# EAGLE design Prius Adaptor PCB Horizontal (EAGLE 9.4.0)
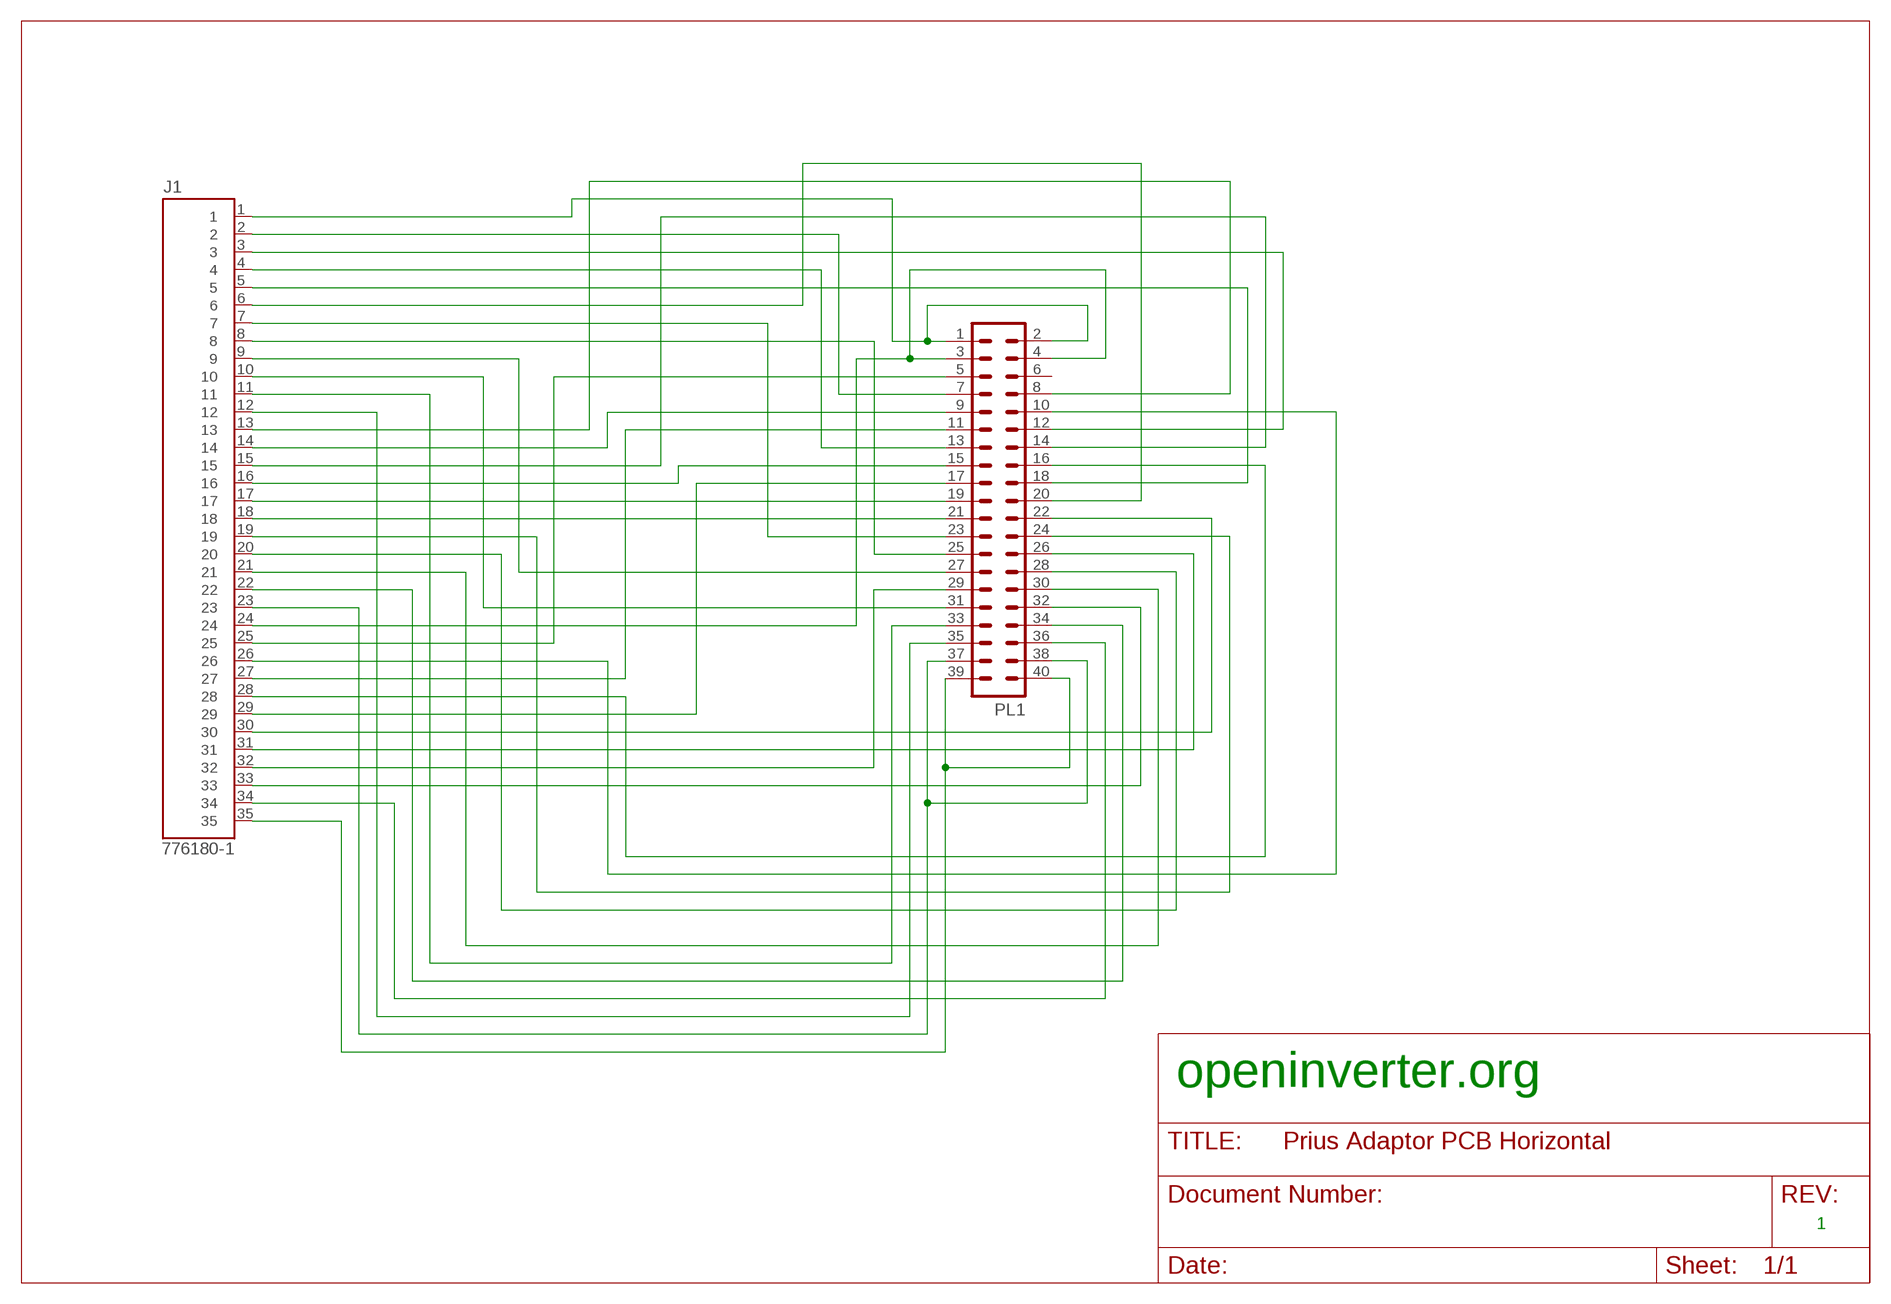
[diagram p0: schematic, sheet 1]

## Parts
J1  776180-1  [TE_776180-1]
PL1  40HNONLATCH  [40HNONLATCH]

## Nets
N$1: J1.6 PL1.20
N$2: J1.17 PL1.19
N$3: J1.29 PL1.17
N$4: J1.5 PL1.18
N$5: J1.16 PL1.15
N$6: J1.28 PL1.16
N$7: J1.4 PL1.13
N$8: J1.15 PL1.14
N$9: J1.27 PL1.11
N$10: J1.3 PL1.12
N$11: J1.14 PL1.9
N$12: J1.26 PL1.10
N$13: J1.2 PL1.7
N$14: J1.13 PL1.8
N$15: J1.25 PL1.5
N$16 [Power]: J1.1 PL1.1 PL1.2
N$17 [Power]: J1.24 PL1.3 PL1.4
N$18: J1.7 PL1.23
N$19: J1.18 PL1.21
N$20: J1.30 PL1.22
N$21: J1.8 PL1.25
N$22: J1.19 PL1.24
N$23: J1.31 PL1.26
N$24: J1.9 PL1.27
N$25: J1.20 PL1.28
N$26: J1.32 PL1.29
N$27: J1.10 PL1.31
N$28: J1.21 PL1.30
N$29: J1.33 PL1.32
N$30: J1.11 PL1.33
N$31: J1.22 PL1.34
N$32: J1.34 PL1.36
N$33: J1.12 PL1.35
N$34 [Power]: J1.23 PL1.37 PL1.38
N$35 [Power]: J1.35 PL1.39 PL1.40
Unconnected: PL1.6

## Notes on the sheet
- openinverter.org
- 1

## Library data of the parts
J1 = 776180-1:776180-1: Conn Rectangular HDR 35 POS Solder RA Thru-Hole Automotive; MANUFACTURER: TE CONNECTIVITY; PARTREV: H7; STANDARD: STANDARED RECOMENDATION
PL1 = Prius Inverter Adaptor:40HNONLATCH: CONNECTOR

## Net classes
0 default: width 0.4 mm, clearance 0.3 mm
1 Signal: width 0.3 mm, clearance 0.2 mm
2 Power: width 1 mm, clearance 0.3 mm

## Board
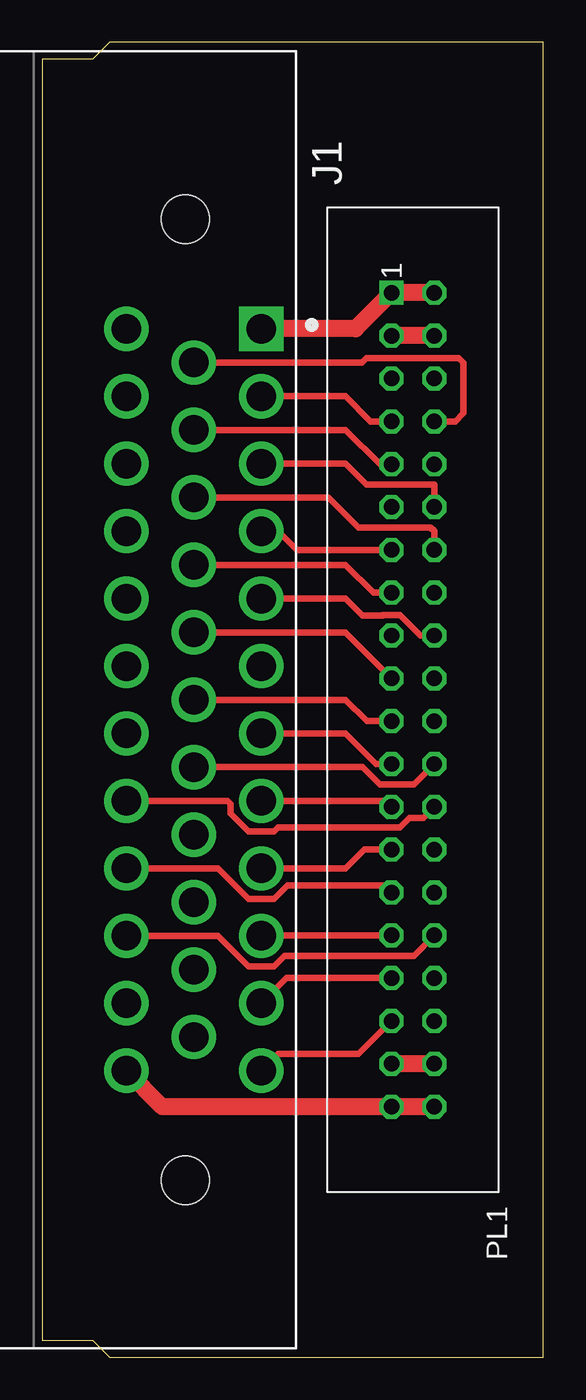
[diagram p1: board, top side]
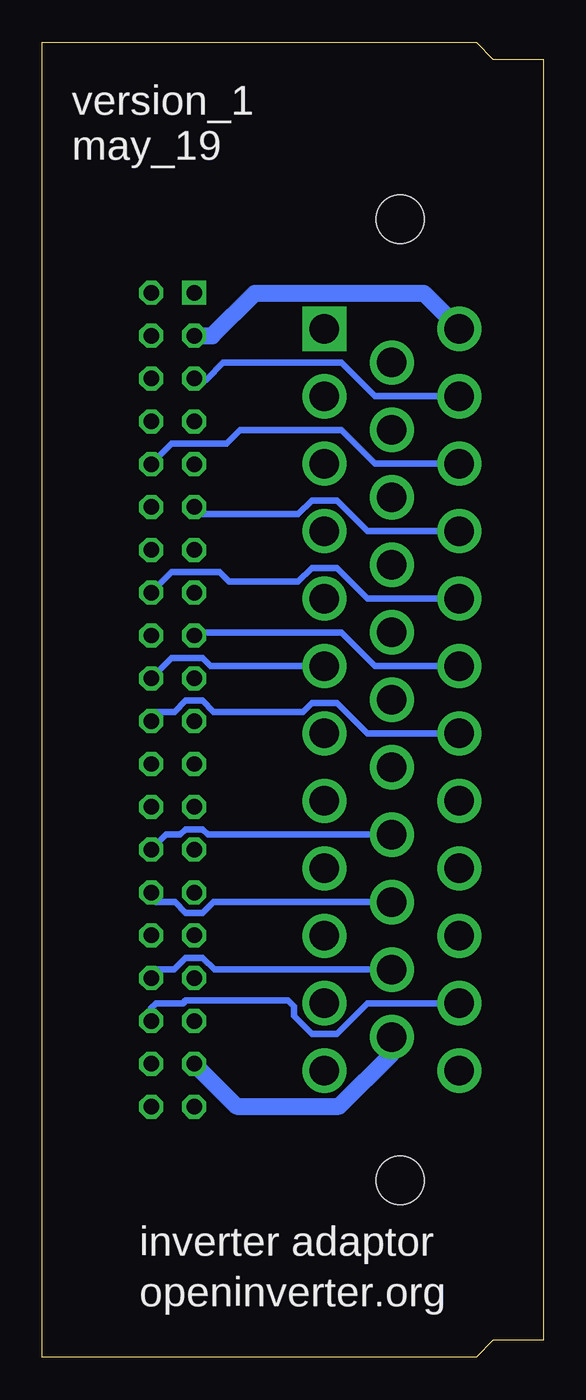
[diagram p2: board, bottom side, seen from below]

Size 29.75 x 78 mm. Coordinates in mm from the lower left corner, seen from the top.
Outline: 0,1 3,1 4,0 29.75,0 29.75,78 4,78 3,77 0,77 0,1
Copper layers (1*16): Top 0.035mm / dielectric 1.5mm / Bottom 0.035mm
Design rules "default": minimum track width 6mil, minimum drill 0.35mm, track to track 6mil, track to pad 6mil, pad to pad 6mil, via to via 6mil, smd to smd 6mil, copper to edge 40mil, drill to drill 6mil, minimum pad ring 10mil, minimum via ring 8mil, stop-mask expansion 4mil, vias tented up to drill 0mil, thermal gap 10mil

### Footprints (pad centres in the part's own frame; a part is rotated, then mirrored left to right if it is on the bottom)
TE_776180-1 = drill 1.75 square: 1 -22,4 | drill 1.75: 2 -18,4; 3 -14,4; 4 -10,4; 5 -6,4; 6 -2,4; 7 2,4; 8 6,4; 9 10,4; 10 14,4; 11 18,4; 12 22,4; 13 -20,0; 14 -16,0; 15 -12,0; 16 -8,0; 17 -4,0; 18 0,0; 19 4,0; 20 8,0; 21 12,0; 22 16,0; 23 20,0; 24 -22,-4; 25 -18,-4; 26 -14,-4; 27 -10,-4; 28 -6,-4; 29 -2,-4; 30 2,-4; 31 6,-4; 32 10,-4; 33 14,-4; 34 18,-4; 35 22,-4 | hole 2.85: -28.5,-0.5; 28.5,-0.5
40HNONLATCH = drill 0.914 square: 1 -24.13,-1.27 | drill 0.914 octagon: 2 -24.13,1.27; 3 -21.59,-1.27; 4 -21.59,1.27; 5 -19.05,-1.27; 6 -19.05,1.27; 7 -16.51,-1.27; 8 -16.51,1.27; 9 -13.97,-1.27; 10 -13.97,1.27; 11 -11.43,-1.27; 12 -11.43,1.27; 13 -8.89,-1.27; 14 -8.89,1.27; 15 -6.35,-1.27; 16 -6.35,1.27; 17 -3.81,-1.27; 18 -3.81,1.27; 19 -1.27,-1.27; 20 -1.27,1.27; 21 1.27,-1.27; 22 1.27,1.27; 23 3.81,-1.27; 24 3.81,1.27; 25 6.35,-1.27; 26 6.35,1.27; 27 8.89,-1.27; 28 8.89,1.27; 29 11.43,-1.27; 30 11.43,1.27; 31 13.97,-1.27; 32 13.97,1.27; 33 16.51,-1.27; 34 16.51,1.27; 35 19.05,-1.27; 36 19.05,1.27; 37 21.59,-1.27; 38 21.59,1.27; 39 24.13,-1.27; 40 24.13,1.27

### Placement (x,y rotation side)
J1  9,39 270 top
PL1  22,39 270 top

### Tracks (layer width: path | path; a pad name or v marks a point on that pad's centre or on a via)
N$1
  Bottom 0.4: J1.6 19.75,41 20.23,41.48 22.06,41.48 PL1.20
N$2
  Top 0.4: J1.17 18,43 PL1.19
N$3
  Bottom 0.4: J1.29 10,41 12,43 20.54,43 PL1.17
N$4
  Top 0.4: J1.5 18,45 19,44 20.21,44 20.23,44.02 21.23,44.02 22.44,42.81 PL1.18
N$5
  Top 0.4: J1.16 18,47 19.65,45.35 PL1.15
N$6
  Bottom 0.4: J1.28 10.44,45 12.25,46.81 13.75,46.81 14.56,46 18.67,46 19.23,46.56 22.06,46.56 PL1.16
N$7
  Top 0.4: J1.4 14,49 15.11,47.89 PL1.13
N$8
  Top 0.4: PL1.14 23.27,49 23.05,49.22 18.77,49.22 16.99,51 J1.15
N$9
  Bottom 0.4: J1.27 10.44,49 12.25,50.81 13.75,50.81 14.56,50 20.3,50 PL1.11
N$10
  Top 0.4: J1.3 18,53 19.24,51.76 23.27,51.76 PL1.12
N$11
  Top 0.4: J1.14 18,55 20.03,52.97 PL1.9
N$12
  Bottom 0.4: J1.26 10,53 12,55 18,55 18.82,54.18 22.06,54.18 PL1.10
N$13
  Top 0.4: J1.2 18,57 19.49,55.51 PL1.7
N$14
  Top 0.4: J1.13 18.97,59 19.23,59.26 24.74,59.26 25,59 25,56 24.51,55.51 PL1.8
N$15
  Bottom 0.4: J1.25 10,57 12,59 19,59 20,58 20.68,58 PL1.5
N$16
  Top 1: J1.1 18.6,61 PL1.1 PL1.2
N$17
  Top 1: PL1.4 PL1.3
  Bottom 1: PL1.3 19.65,60.59 17.13,63.11 7.11,63.11 J1.24
N$18
  Top 0.4: J1.7 18,37 19.81,35.19 PL1.23
N$19
  Top 0.4: J1.18 18,39 19.27,37.73 PL1.21
N$20
  Bottom 0.4: J1.30 10.44,37 12.25,38.81 13.75,38.81 14.28,38.28 19.57,38.28 20.23,38.94 21.23,38.94 21.89,38.28 23,38.28 23.27,38.01 PL1.22
N$21
  Top 0.4: PL1.25 20.38,33 J1.8
N$22
  Top 0.4: J1.19 19.01,35 20.03,33.98 22.06,33.98 PL1.24
N$23
  Top 0.4: J1.31 11,33 11.19,32.81 11.19,32.25 12.25,31.19 13.75,31.19 14,31.44 21.23,31.44 21.79,32 22.62,32 PL1.26
N$24
  Top 0.4: J1.9 18,29 19.11,30.11 PL1.27
N$25
  Bottom 0.4: J1.20 19.91,31 20.23,31.32 21.23,31.32 21.55,31 22.38,31 PL1.28
N$26
  Top 0.4: J1.32 10.44,29 12.25,27.19 13.75,27.19 14.56,28 20.3,28 PL1.29
N$27
  Top 0.4: J1.10 13.03,25.03 PL1.31
N$28
  Bottom 0.4: J1.21 19.59,27 20.23,26.36 21.23,26.36 21.87,27 23,27 23.27,27.27 PL1.30
N$29
  Top 0.4: J1.33 10.44,25 12.25,23.19 13.75,23.19 14.38,23.82 22.06,23.82 PL1.32
N$30
  Top 0.4: J1.11 14.49,22.49 PL1.33
N$31
  Bottom 0.4: J1.22 19.53,23 20.23,23.7 21.23,23.7 21.93,23 23,23 23.27,22.73 PL1.34
N$32
  Bottom 0.4: J1.34 10.44,21 12.25,19.19 13.75,19.19 14.81,20.25 14.81,20.81 15.16,21.16 21.23,21.16 21.39,21 23,21 23.27,20.73 PL1.36
N$33
  Top 0.4: J1.12 14,18 18.78,18 PL1.35
N$34
  Top 1: PL1.38 PL1.37
  Bottom 1: PL1.37 18.21,14.89 12.12,14.89 9,18.01 J1.23
N$35
  Top 1: J1.35 7.13,14.87 PL1.39 PL1.40

### Text on the board
bNames: version_1 / may_19 | inverter adaptor | openinverter.org